# Altium schematic sheet MCU_REVB_2.SchDoc: Big-MCU
size 270 x 223 mm; Origin: Eagle; Date: 2023-01-13 8:42:14 AM; SheetNumber: 3; GateName_1: G$1; SymbolName_1: LETTER_L; LibraryName: frames; DeviceSetName: LETTER_L; GateName_2: G$2; SymbolName_2: DOCFIELD; Sheet: Sheet:; REV: REV:
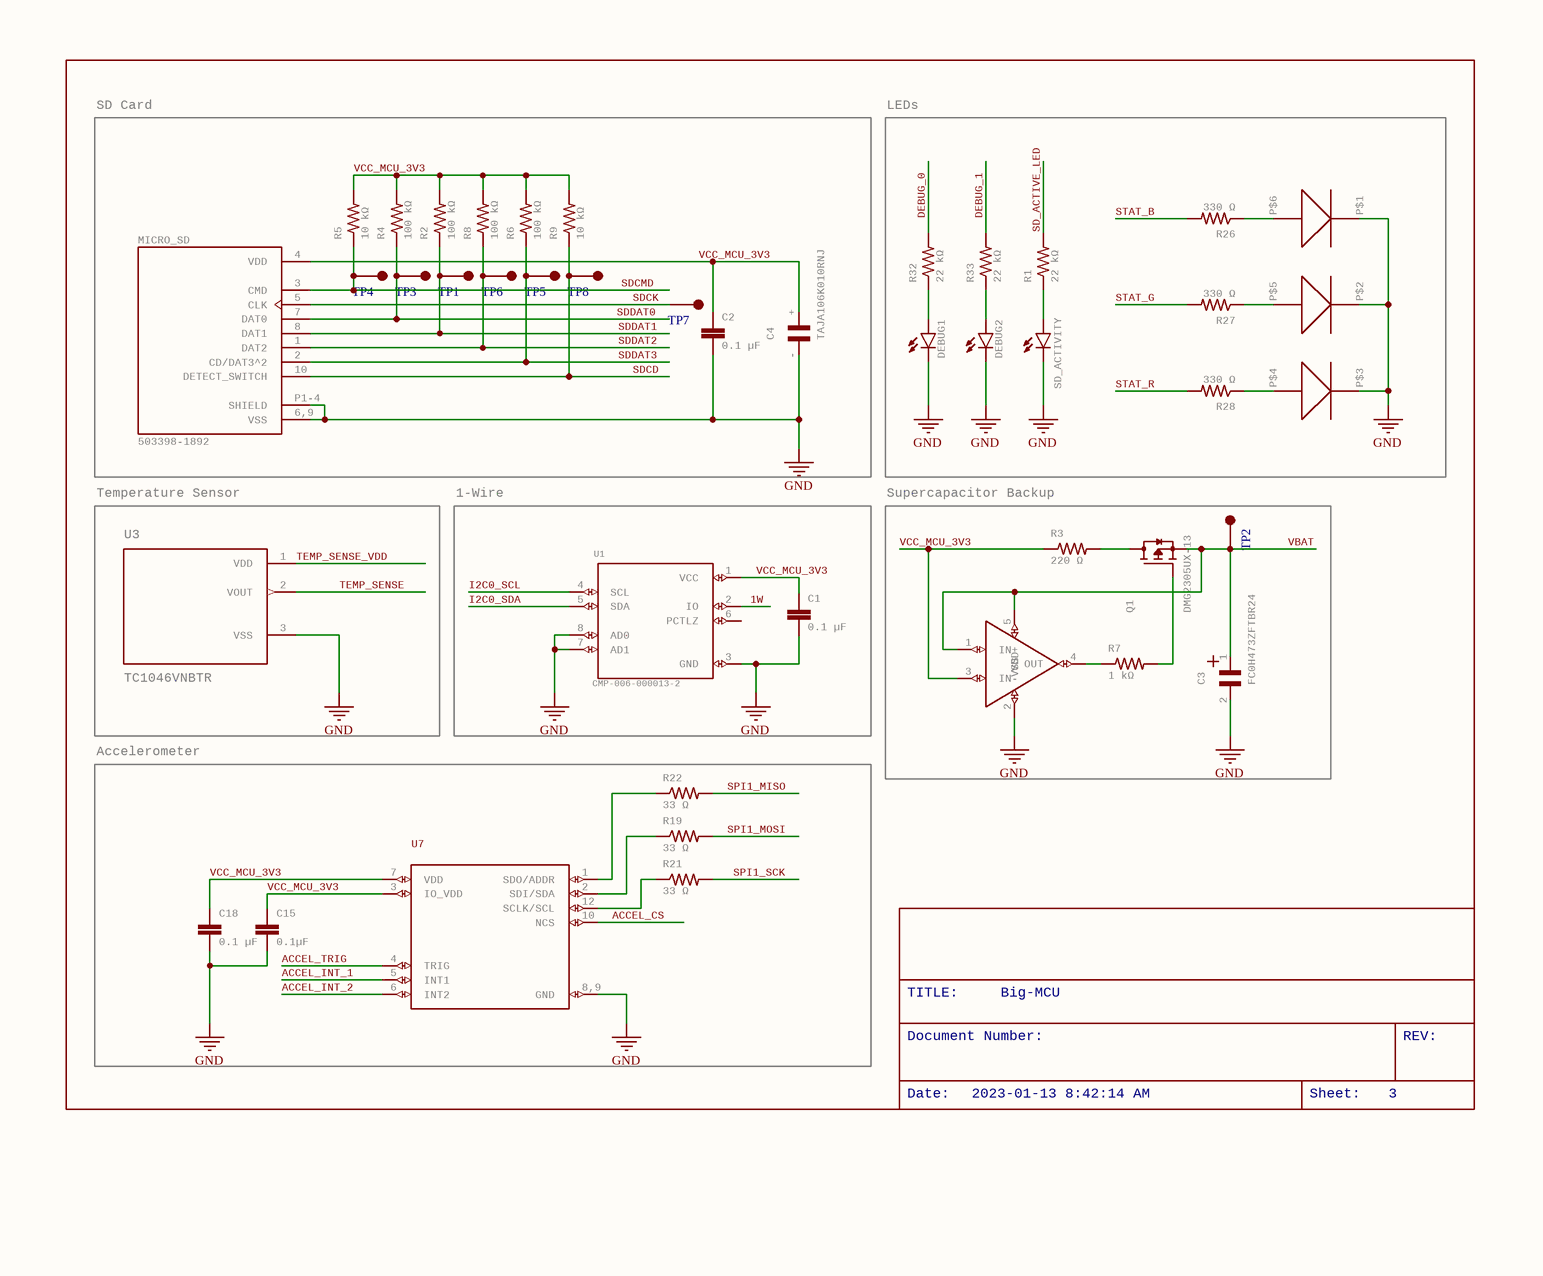
[diagram p0: MCU_REVB_2.SchDoc]

## Parts
C1  0.1 µF  [C0805]
C2  0.1 µF  [C0805]
C3  FC0H473ZFTBR24  [CAPAE1080X580N]
C4  TAJA106K010RNJ  [FP-TAJA-MFG]
C15  0.1µF  [C0805]
C18  0.1 µF  [C0805]
DEBUG1  LEDSML0805  [6-0805_N]  (value not drawn)
DEBUG2  LEDSML0805  [6-0805_N]  (value not drawn)
MICRO_SD  503398-1892  [MOLX-503398-1892_V]
Q1  DMG2305UX-13  [FP-SOT23-MFG]
R1  22 kΩ  [6-0805_N]
R2  100 kΩ  [6-0805_N]
R3  220 Ω  [6-0805_N]
R4  100 kΩ  [6-0805_N]
R5  10 kΩ  [6-0805_N]
R6  100 kΩ  [6-0805_N]
R7  1 kΩ  [6-0805_N]
R8  100 kΩ  [6-0805_N]
R9  10 kΩ  [6-0805_N]
R19  33 Ω  [6-0805_N]
R21  33 Ω  [6-0805_N]
R22  33 Ω  [6-0805_N]
R26  330 Ω  [6-0805_N]
R27  330 Ω  [6-0805_N]
R28  330 Ω  [6-0805_N]
R32  22 kΩ  [6-0805_N]
R33  22 kΩ  [6-0805_N]
SD_ACTIVITY  LEDSML0805  [6-0805_N]  (value not drawn)
STATUS  MSL0402RGB  [FP-MSL0402-MFG]  (value not drawn)
TP1  5015  [KEYSTONE_5015]  (value not drawn)
TP2  5015  [KEYSTONE_5015]  (value not drawn)
TP3  5015  [KEYSTONE_5015]  (value not drawn)
TP4  5015  [KEYSTONE_5015]  (value not drawn)
TP5  5015  [KEYSTONE_5015]  (value not drawn)
TP6  5015  [KEYSTONE_5015]  (value not drawn)
TP7  5015  [KEYSTONE_5015]  (value not drawn)
TP8  5015  [KEYSTONE_5015]  (value not drawn)
U1  CMP-006-000013-2  [SOIC127P600X175-8N]
U2  BU7265SG-TR  [SOT95P280X125-5N]  (value not drawn)
U3  TC1046VNBTR  [SOT-23-NB3_N]
U7  KX134-1211  [FP-KX134-1211-MFG]  (value not drawn)

## Blocks framed on the sheet
SD Card: C2 C4 MICRO_SD R2 R4-R6 R8 R9 TP1 TP3-TP8
LEDs: DEBUG1 DEBUG2 R1 R26-R28 R32 R33 SD_ACTIVITY STATUS
Temperature Sensor: U3
1-Wire: C1 U1
Supercapacitor Backup: C3 Q1 R3 R7 TP2 U2
Accelerometer: C15 C18 R19 R21 R22 U7

## Nets
GND: C1.2 C2.2 C3.2 C4.- C15.2 C18.2 DEBUG1.2(C) DEBUG2.2(C) MICRO_SD.6,9(VSS) MICRO_SD.P1-4(SHIELD) SD_ACTIVITY.2(C) STATUS.P1(P$1) STATUS.P2(P$2) STATUS.P3(P$3) U1.3(GND) U1.7(AD1) U1.8(AD0) U2.2(VSS) U3.3(VSS) U7.8,9(GND)
1W: U1.2(IO)
ACCEL_CS: U7.10(NCS)
ACCEL_INT_1: U7.5(INT1)
ACCEL_INT_2: U7.6(INT2)
ACCEL_TRIG: U7.4(TRIG)
DEBUG_0: R32.2
DEBUG_1: R33.2
I2C0_SCL: U1.4(SCL)
I2C0_SDA: U1.5(SDA)
SD_ACTIVE_LED: R1.2
SDCD: MICRO_SD.10(DETECT_SWITCH) R9.1 TP8.1(TP)
SDCK: MICRO_SD.5(CLK) TP7.1(TP)
SDCMD: MICRO_SD.3(CMD) R5.1 TP4.1(TP)
SDDAT0: MICRO_SD.7(DAT0) R4.1 TP3.1(TP)
SDDAT1: MICRO_SD.8(DAT1) R2.1 TP1.1(TP)
SDDAT2: MICRO_SD.1(DAT2) R8.1 TP6.1(TP)
SDDAT3: MICRO_SD.2(CD/DAT3^2) R6.1 TP5.1(TP)
SPI1_MISO: R22.2
SPI1_MOSI: R19.2
SPI1_SCK: R21.2
STAT_B: R26.2
STAT_G: R27.2
STAT_R: R28.2
TEMP_SENSE: U3.2(VOUT)
TEMP_SENSE_VDD: U3.1(VDD)
VBAT: C3.1 Q1.2(S) TP2.1(TP) U2.1(IN+) U2.5(VDD)
VCC_MCU_3V3: C1.1 C2.1 C4.+ C15.1 C18.1 MICRO_SD.4(VDD) R2.2 R3.1 R4.2 R5.2 R6.2 R8.2 R9.2 U1.1(VCC) U2.3(IN-) U7.3(IO_VDD) U7.7(VDD)
NetDEBUG1_1: DEBUG1.1(A) R32.1
NetDEBUG2_1: DEBUG2.1(A) R33.1
NetQ1_1: Q1.1(G) R7.2
NetQ1_3: Q1.3(D) R3.2
NetR1_1: R1.1 SD_ACTIVITY.1(A)
NetR7_1: R7.1 U2.4(OUT)
NetR19_1: R19.1 U7.2(SDI/SDA)
NetR21_1: R21.1 U7.12(SCLK/SCL)
NetR22_1: R22.1 U7.1(SDO/ADDR)
NetR26_1: R26.1 STATUS.P6(P$6)
NetR27_1: R27.1 STATUS.P5(P$5)
NetR28_1: R28.1 STATUS.P4(P$4)

Not connected (* = marked no-connect by the designer): U1 6(PCTLZ)

## Notes on the sheet
- TITLE:
- Big-MCU
- Document Number:
- REV:
- Date:
- 2023-01-13 8:42:14 AM
- Sheet:
- 3

## Library data of the parts
C1 C2 C15 C18 = C-EUC0805: CAPACITOR, European symbol; GateName_1: G$1; SymbolName_1: C-EU; POPULARITY: 88; DeviceName: C0805; LibraryName: rcl; DeviceSetName: C-EU; SPICEPREFIX: C
C3 = CMP-002-000008-3: GateName_1: G$1; SymbolName_1: CAP_POL; LibraryName: MCU Board; DeviceSetName: FC0H473ZFTBR24; Component Type: Standard; Design Item ID: FC0H473ZFTBR24; Package: CAPAE1080X580N; Pin Count: 2; Source: MCU Board.SCHLIB
C4 = CMP-002-000009-2: Cap Tant Solid 10uF 10V A CASE 10%( 3.2 X 1.6 X 1.6mm) Inward L SMD 3216-18 3 Ohm 125C T/R; pin to pad: +>2 ->1; GateName_1: G$1; SymbolName_1: CAP; LibraryName: MCU Board; DeviceSetName: TAJA106K010RNJ; Component Type: Standard; Design Item ID: TAJA106K010RNJ; Package: 1206-POL; Pin Count: 2; Source: MCU Board.SCHLIB
DEBUG1 DEBUG2 SD_ACTIVITY = LEDSML0805: LED   OSRAM: - CHIPLED LG R971, LG N971, LY N971, LG Q971, LY Q971, LO R971, LY R971 LH N974, LH R974 LS Q976, LO Q976, LY Q976 LO Q996 - Hyper CHIPLED LW Q18S LB Q993, LB Q99A, LB R99A - SideLED LS A670, LO A670, LY A670, LG A670, LP A670 LB A673, LV A673, LT A673, LW A673 LH A674 LY A675 LS A676, LA A676, LO A676, LY A676, LW A676 LS A679, LY A679, LG A679 -  Hyper Micro SIDELEDÂ® LS Y876, LA Y876, LO Y876, LY Y876 LT Y87S - SmartLED LW L88C, LW L88S LB L89C, LB L89S, LG L890 LS L89K, LO L89K, LY L89K LS L896, LA L896, LO L896, LY L896 - TOPLED LS T670, LO T670, LY T670, LG T670, LP T670 LSG T670, LSP T670, LSY T670, LOP T670, LYG T670 LG T671, LOG T671, LSG T671 LB T673, LV T673, LT T673, LW T673 LH T674 LS T676, LA T676, LO T676, LY T676, LB T676, LH T676, LSB T676, LW T676 LB T67C, LV T67C, LT T67C, LS T67K, LO T67K, LY T67K, LW E67C LS E67B, LA E67B, LO E67B, LY E67B, LB E67C, LV E67C, LT E67C LW T67C LS T679, LY T679, LG T679 LS T770, LO T770, LY T770, LG T770, LP T770 LB T773, LV T773, LT T773, LW T773 LH T774 LS E675, LA E675, LY E675, LS T675 LS T776, LA T776, LO T776, LY T776, LB T776 LHGB T686 LT T68C, LB T68C - Hyper Mini TOPLEDÂ® LB M676 - Mini TOPLED SantanaÂ® LG M470 LS M47K, LO M47K, LY M47K    Source: http://www.osram.convergy.de   LUXEON: - LUMILEDÂ® LXK2-PW12-R00, LXK2-PW12-S00, LXK2-PW14-U00, LXK2-PW14-V00 LXK2-PM12-R00, LXK2-PM12-S00, LXK2-PM14-U00 LXK2-PE12-Q00, LXK2-PE12-R00, LXK2-PE12-S00, LXK2-PE14-T00, LXK2-PE14-U00 LXK2-PB12-K00, LXK2-PB12-L00, LXK2-PB12-M00, LXK2-PB14-N00, LXK2-PB14-P00, LXK2-PB14-Q00 LXK2-PR12-L00, LXK2-PR12-M00, LXK2-PR14-Q00, LXK2-PR14-R00 LXK2-PD12-Q00, LXK2-PD12-R00, LXK2-PD12-S00 LXK2-PH12-R00, LXK2-PH12-S00 LXK2-PL12-P00, LXK2-PL12-Q00, LXK2-PL12-R00    Source: www.luxeon.com   KINGBRIGHT:   KA-3528ASYC Source: www.kingbright.com; GateName_1: G$1; POPULARITY: 17; SymbolName_1: LED; DeviceName: SML0805; LibraryName: led; DeviceSetName: LED
MICRO_SD = CMP-006-000002-3: 1.10mm Pitch microSD Memory Card Connector, Normal Mount Surface Mount, Push-Push Type, 1.28mm Height; pin to pad: 6,9>6+9 P1-4>11+12+13+14; GateName_1: G$1; Current Rating: 500mA; Gender: Male; Number of Contacts: 8; Pitch: 1.1mm; Voltage Rating (AC): 10V; SymbolName_1: 503398-1892; LibraryName: MCU Board; DeviceSetName: 503398-1892; Component Type: Standard; Design Item ID: 503398-1892; Package: MOLEX_503398-1892; Pin Count: 10; Source: MCU Board.SCHLIB; Number of Rows: 1; RoHS Compliant: Yes; Housing Material: Thermoplastic; Connector Type: Connector; Radiation Hardening: No; Series: 503398; Halogen Free: Low Halogen; Contact Plating: Gold; Max Operating Temperature: 85°C; Depth: 14.05mm; Min Operating Temperature: -25°C; Length: 13.6mm; Packaging: Tape and Reel; Package Quantity: 2400; Contact Material: Bronze,Stainless Steel; Mounting Technology: Surface Mount; Width: 14.05mm; Number of Circuits: 8; Termination: Solder; Orientation: Right Angle
Q1 = CMP-006-000012-2: P-Channel 20 V 65 Ohms Surface Mount Enhancement Mode Mosfet - SOT-23-3; GateName_1: G$1; MF: Diodes Zetex; Drain-source On Resistance-Max: 65MR; Threshold Voltage: -900mV; Drain to Source Resistance: 52mR; Max Power Dissipation: 1.4W; Rise Time: 13.7ns; Continuous Drain Current (ID): 4.2A; Number of Channels: 1; Drain to Source Voltage (Vdss): 20V; Input Capacitance: 808pF; Fall Time: 34.7ns; Element Configuration: Single; Turn-On Delay Time: 10.8ns; Gate to Source Voltage (Vgs): 8V; Turn-Off Delay Time: 79.3ns; Drain to Source Breakdown Voltage: -20V; SymbolName_1: DMG2305UX-13; LibraryName: MCU Board; DeviceSetName: DMG2305UX-13; AVAILABILITY: Good; MP: DMG2305UX-13; Package: SOT91P240X110-3N; PRICE: None; PURCHASE-URL: https://pricing.snapeda.com/search/part/DMG2305UX-13/?ref=eda; Design Item ID: DMG2305UX-13; Source: MCU Board.SCHLIB; Pin Count: 3; Component Type: Standard; Series: -; RoHS Compliant: Yes; Mounting Technology: Surface Mount; Radiation Hardening: No; Width: 1.4mm; Height: 1.1mm; Reach SVHC Compliant: Yes; Lead Free: Lead Free; On-State Resistance: 65MR; Max Operating Temperature: 150°C; Rds On Max: 52mR; Packaging: Tape and Reel; Pins: 3; Min Operating Temperature: -55°C; Weight: 0.000282oz; Package Quantity: 1; Case/Package: SOT-23; Polarity: P-CHANNEL; Length: 3mm
R1-R9 R19 R21 R22 R26-R28 R32 R33 = R-US_R0805: RESISTOR, American symbol; GateName_1: G$1; SymbolName_1: R-US; DeviceName: R0805; DeviceSetName: R-US_; POPULARITY: 85; LibraryName: rcl; SPICEPREFIX: R
STATUS = CMP-003-000006-2: LEDRGBDIFFUSEDSMD; pin to pad: P1>1 P2>2 P3>3 P4>4 P5>5 P6>6; GateName_1: G$1; SymbolName_1: MSL0402RGB; LibraryName: MCU Board; DeviceSetName: MSL0402RGB; Component Type: Standard; Design Item ID: MSL0402RGB; Package: MSL0402RGB; Pin Count: 6; Source: MCU Board.SCHLIB
TP1-TP8 = CMP-005-000003-3: GateName_1: G$1; MF: Keystone Electronics; SymbolName_1: 5015; LibraryName: MCU Board; DeviceSetName: 5015; AVAILABILITY: Unavailable; MOUSER-PURCHASE-URL: https://snapeda.com/shop?store=Mouser&id=48459; MP: 5015; Package: KEYSTONE_5015; PRICE: None; Component Type: Standard; Pin Count: 1; Source: MCU Board.SCHLIB; Design Item ID: 5015
U1 = CMP-006-000013-2: ds2482-100 single-channel 1-wire master i_c to 1-wire bridge device that interfaces directly to standard (100khz...; GateName_1: G$1; SymbolName_1: DS2482-100; LibraryName: MCU Board; DeviceSetName: DS2482-100; Component Type: Standard; Package: SOIC8; Design Item ID: DS2482-100; Pin Count: 8; Source: MCU Board.SCHLIB
U2 = CMP-006-000009-3: Operational Amplifier, Single, 4 kHz, 1, 2.4 V/ms, 1.8V to 5.5V, SSOP, 5 RoHS Compliant: Yes; GateName_1: G$1; SymbolName_1: OP-AMP; Slew Rate: 0.024V/µs; Gain Bandwidth Product: 4kHz; Amplifier Type: GENERAL PURPOSE; Number of Amplifiers: 1; Common Mode Rejection Ratio: 45dB; Input Offset Voltage (Vos): 1mV; Output Current per Channel: 4mA; Voltage Gain: 95dB; Operating Supply Current: 350nA; Input Bias Current: 1pA; LibraryName: MCU Board; DeviceSetName: BU7265SG-TR; Package: SOT95P285X145-5N; Pin Count: 5; Source: MCU Board.SCHLIB; Component Type: Standard; Design Item ID: BU7265SG-TR; Case/Package: SSOP; Bandwidth: 4kHz; Number of Circuits: 1; Series: -; Lead Free: Lead Free; Min Operating Temperature: -40°C; Radiation Hardening: No; RoHS Compliant: Yes; Max Operating Temperature: 105°C; Max Supply Voltage: 5.5V; Pins: 5; Package Quantity: 1; Min Supply Voltage: 1.8V; Mounting Technology: Surface Mount; Packaging: Tape and Reel
U3 = CMP-006-000023-2: Analog Output Temperature Sensor, 2.7 to 4.4V, SOT-23-3, RoHS; GateName_1: A; MF: Microchip; Min Supply Voltage: 2.7V; Output Type: Analog,Analog Voltage,Voltage; Max Output current: 100uA; Operating Supply Voltage: 3.3V; Operating Supply Current: 60uA; Accuracy: 2%; SymbolName_1: TC1046VNBTR; LibraryName: MCU Board; DeviceSetName: TC1046VNBTR; ARROW_ELECTRONICS-PURCHASE-URL: https://snapeda.com/shop?store=Arrow+Electronics&id=234729; AVAILABILITY: Good; DIGIKEY-PURCHASE-URL: https://snapeda.com/shop?store=DigiKey&id=234729; MOUSER-PURCHASE-URL: https://snapeda.com/shop?store=Mouser&id=234729; MP: TC1046VNBTR; Package: SOT95P237X112-3N; PRICE: None; Component Type: Standard; Design Item ID: TC1046VNBTR; Pin Count: 3; Source: MCU Board.SCHLIB; Height: 1.02mm; Mounting Technology: Surface Mount; RoHS Compliant: Yes; Radiation Hardening: No; Length: 3.05mm; Lead Free: Lead Free; Max Operating Temperature: 125°C; Contact Plating: Tin,Matte; Case/Package: TO-236-3; Width: 1.4mm; Termination: SMD/SMT; Package Quantity: 3000; Reach SVHC Compliant: Yes; Sensor Type: Temperature; Output Current: 100uA; Max Supply Voltage (DC): 4.4V; Series: -; Min Operating Temperature: -40°C; Pins: 3; Min Supply Voltage (DC): 2.7V; Max Supply Voltage: 4.4V; Packaging: Tape and Reel
U7 = CMP-006-000015-2: KX134 Series 3.6 V ±8g/16g/32g/64g SMT 3 Axis Digital Accelerometer- LGA-12; pin to pad: 8,9>8+9; GateName_1: G$1; Axis: X, Y, Z; Output Type: SPI,I2C; Bandwidth: 0.39Hz; SymbolName_1: KX134-1211; LibraryName: MCU Board; DeviceSetName: KX134-1211; Component Type: Standard; Source: MCU Board.SCHLIB; Package: KX134-1211; Pin Count: 10; Design Item ID: KX134-1211; Case/Package: VFLGA; Series: -; Max Operating Temperature: 105°C; Mounting Technology: Surface Mount; Min Operating Temperature: -40°C